# EasyEDA schematic Converter-with-HeadphonesAMP.json
TITLE: Sheet_1; REV: 1.0; Date: 2023-11-09; Sheet: 1/1; Drawn By: Alex-Kaut; Company: Your Company
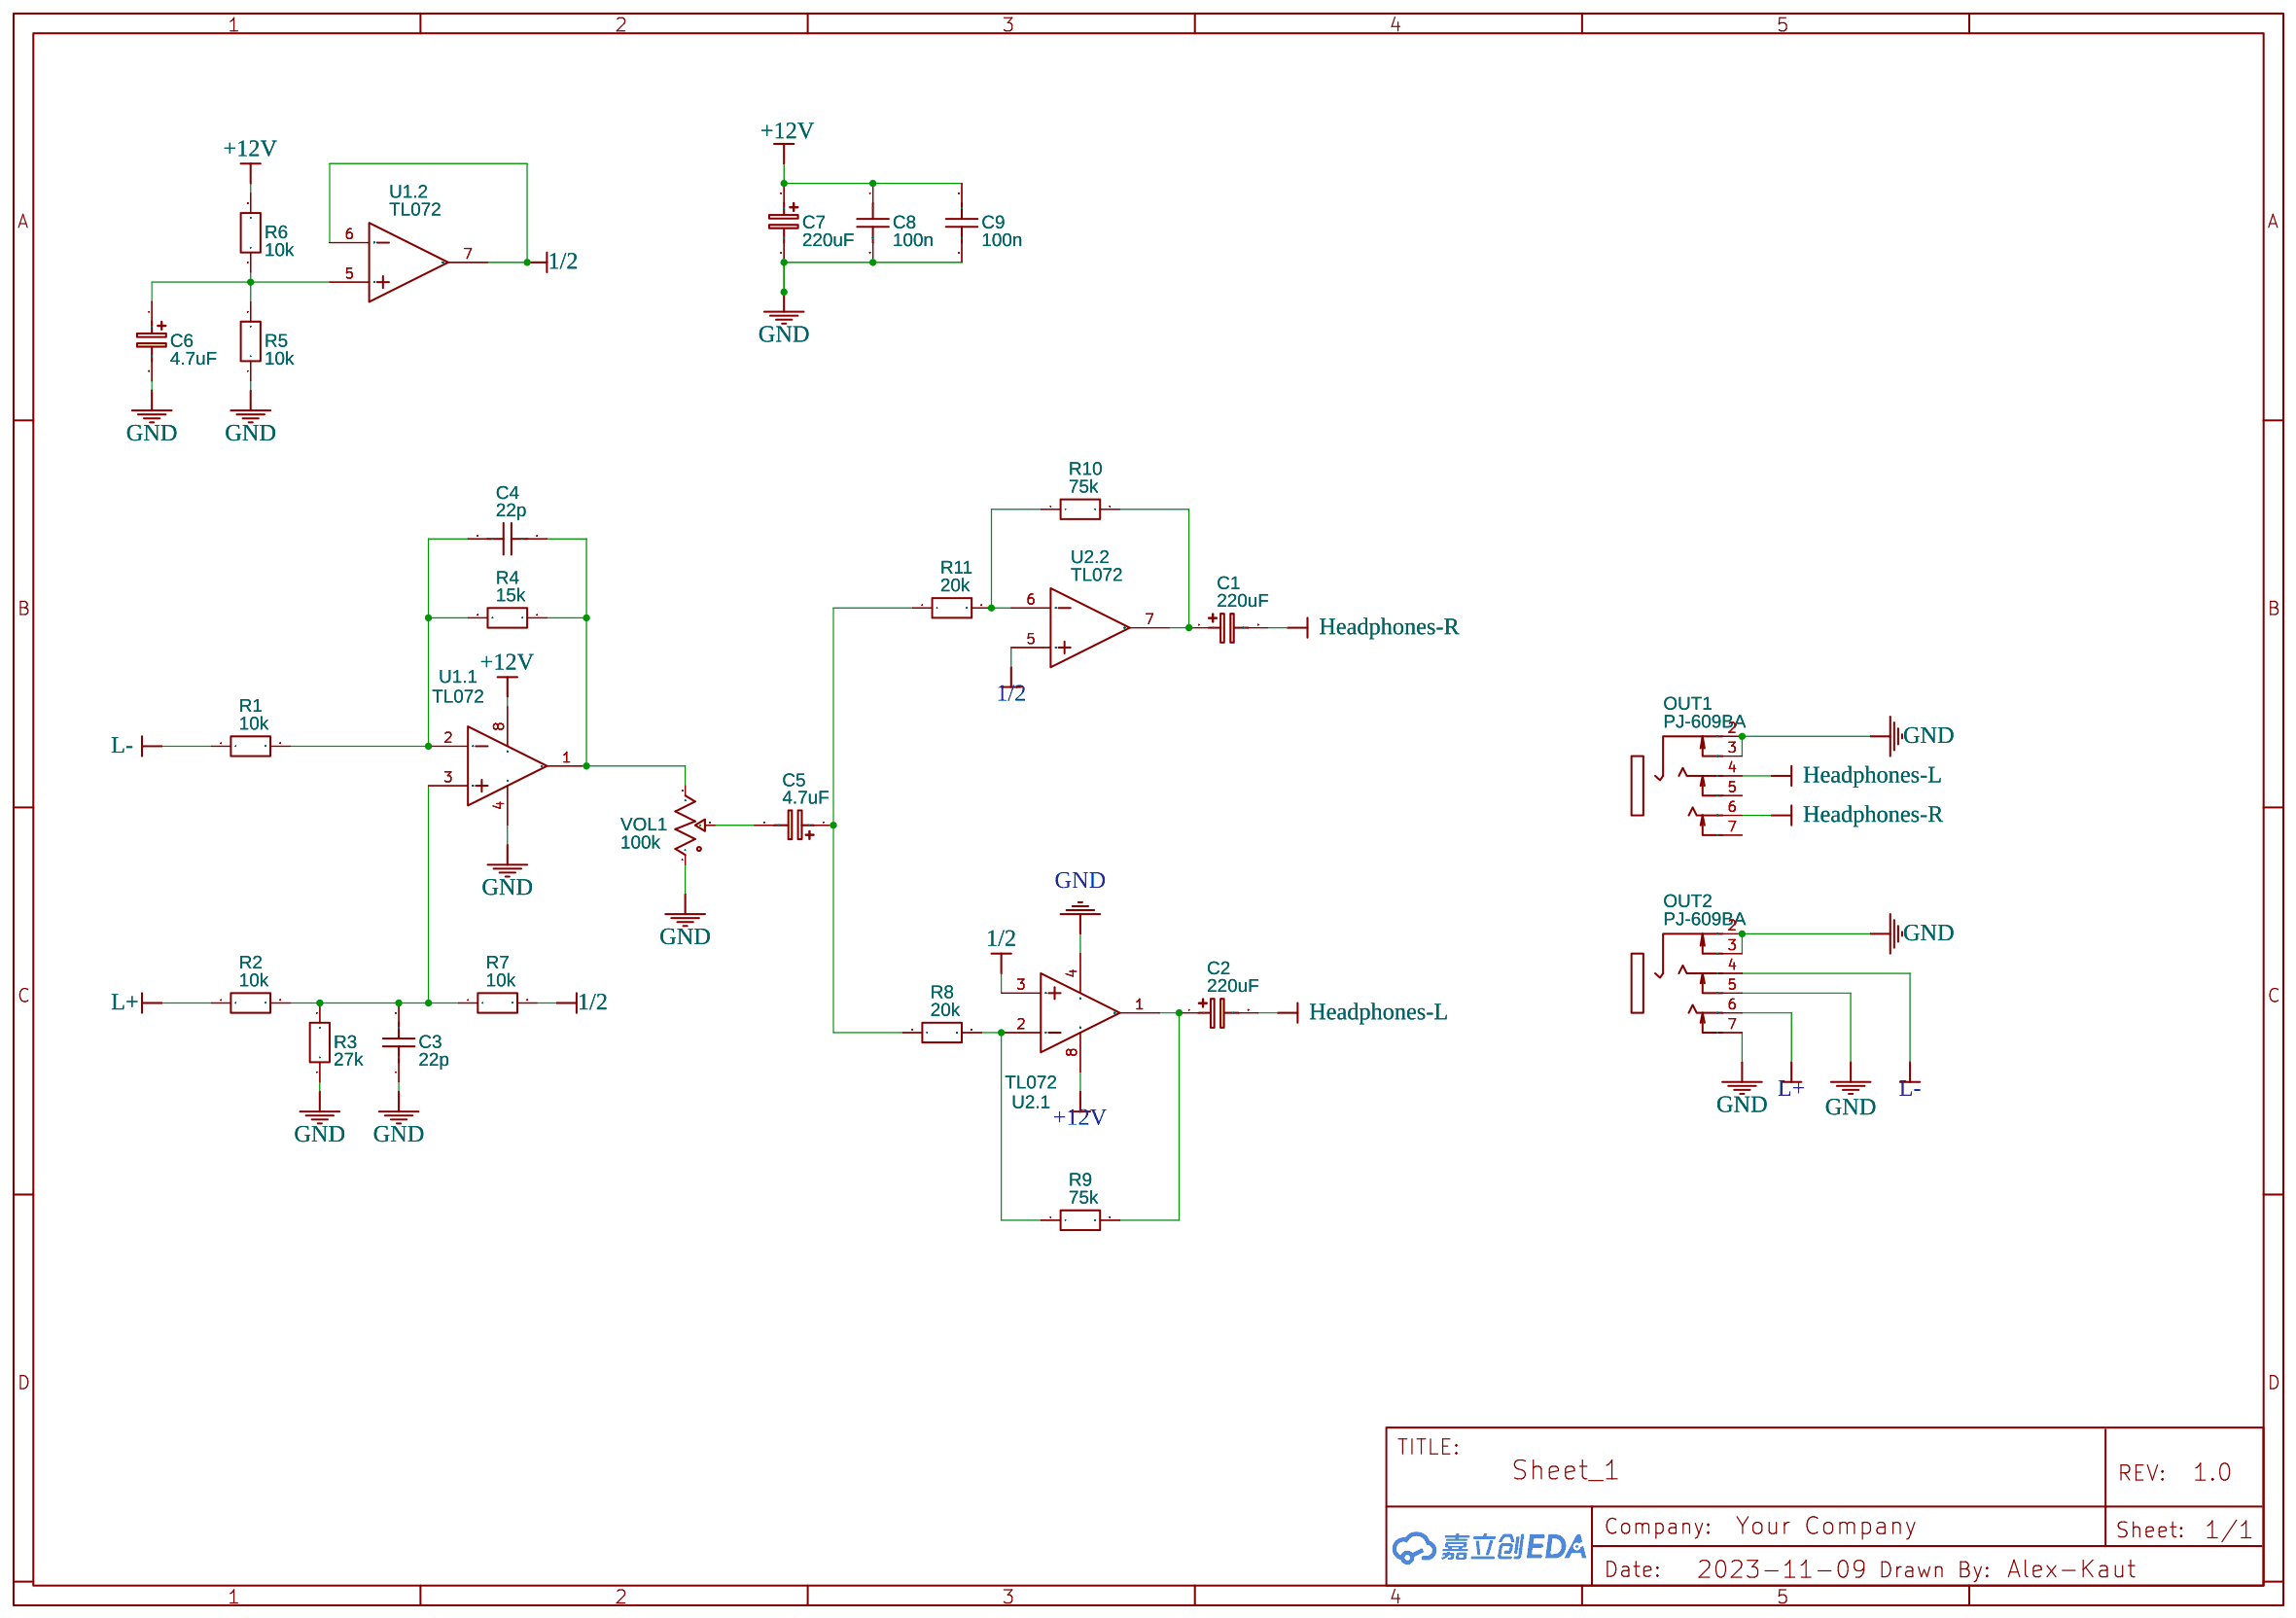
[diagram p0: schematic sheet]

## Parts
C1  220uF  [CAP-D6.3×F2.5]
C2  220uF  [CAP-D6.3×F2.5]
C3  22p  [RAD-0.2]
C4  22p  [RAD-0.2]
C5  4.7uF  [CAP-D6.3×F2.5]
C6  4.7uF  [CAP-D6.3×F2.5]
C7  220uF  [CAP-D6.3×F2.5]
C8  100n  [RAD-0.2]
C9  100n  [RAD-0.2]
OUT1  PJ-609BA  [PJ-609BA]
OUT2  PJ-609BA  [PJ-609BA]
R1  10k  [R_AXIAL-0.3]
R2  10k  [R_AXIAL-0.3]
R3  27k  [R_AXIAL-0.3]
R4  15k  [R_AXIAL-0.3]
R5  10k  [R_AXIAL-0.3]
R6  10k  [R_AXIAL-0.3]
R7  10k  [R_AXIAL-0.3]
R8  20k  [R_AXIAL-0.3]
R9  75k  [R_AXIAL-0.3]
R10  75k  [R_AXIAL-0.3]
R11  20k  [R_AXIAL-0.3]
U1  TL072  [DIP-8_L10.1-W6.3-P2.54-LS7.6-BL]  (sections 1,2)
U2  TL072  [DIP-8_L10.1-W6.3-P2.54-LS7.6-BL]  (sections 1,2)
VOL1  100k  [POT_ALPHA_16MM]

## Library data of the parts
C1 C2 C5-C7 = CE_TH_D6.3×F2.5_EU: Contributor: LCEDA_Lib
C3 C4 C8 C9 = C_RAD-0.2_US: Contributor: LCEDA_Lib
OUT1 OUT2 = -: Supplier: LCSC; Supplier Part: C309277; Manufacturer: HOOYA; Contributor: LCSC
R1-R11 = R_AXIAL-0.3_EU: Contributor: LCEDA_Lib
U1 U2 = TL082CP COPY: tags: FET Operational Amplifier; Supplier Part: C75052; Supplier: LCSC; Manufacturer: TI; Manufacturer Part: TL082CP; subpart_no: 2; image: http://image.lceda.cn/szlcsc/C75052.jpg
VOL1 = POT ALPHA 16MM VERTICAL: Manufacturer Part: Alpha 9mm; Contributor: modlfo

## Nets
+12V: C7.1 C8.1 C9.1 R6.2 U1.8(VCC+) U2.8(VCC+)
GND: C3.1 C6.2 C7.2 C8.2 C9.2 OUT1.2 OUT1.3 OUT2.2 OUT2.3 OUT2.5 OUT2.7 R3.1 R5.1 U1.4(VCC-) U2.4(VCC-) VOL1.1
1/2: R7.2 U1.6(IN2-) U1.7(OUT2) U2.3(IN1+) U2.5(IN2+)
Headphones-L: C2.2 OUT1.4
Headphones-R: C1.2 OUT1.6
L+: OUT2.6 R2.1
L-: OUT2.4 R1.1
Net-(C1-1): C1.1 R10.2 U2.7(OUT2)
Net-(C2-1): C2.1 R9.2 U2.1(OUT1)
Net-(C3-2): C3.2 R2.2 R3.2 R7.1 U1.3(IN1+)
Net-(C4-1): C4.1 R4.1 U1.1(OUT1) VOL1.3
Net-(C4-2): C4.2 R1.2 R4.2 U1.2(IN1-)
Net-(C5-1): C5.1 R8.1 R11.1
Net-(C5-2): C5.2 VOL1.2
Net-(C6-1): C6.1 R5.2 R6.1 U1.5(IN2+)
Net-(R8-2): R8.2 R9.1 U2.2(IN1-)
Net-(R10-1): R10.1 R11.2 U2.6(IN2-)

Not connected (* = marked no-connect by the designer): OUT1 5 7
